# Altium schematic sheet hdmi_wing.SchDoc: POSEDGE HDMI Wing
size A4; Organization: www.posedge.ir; Address1: TORANJ Inc.; Address2: Isfahan Science and; Address3: Technology Town, Isfahan; Address4: IRAN; Revision: A
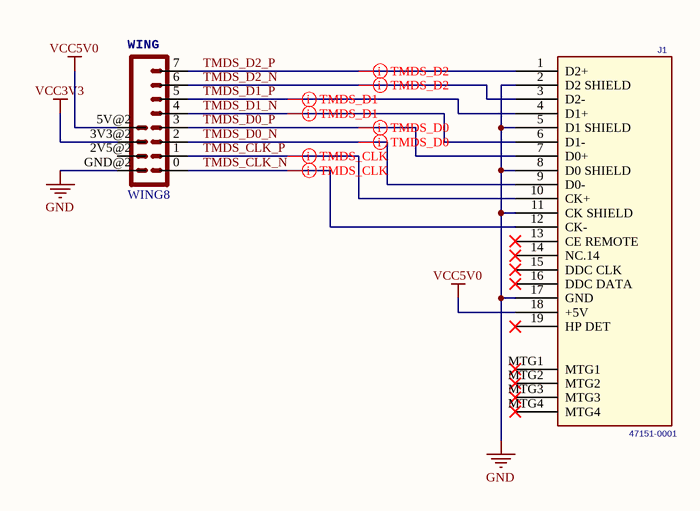
[diagram p0: hdmi_wing.SchDoc]

## Parts
J1  47151-0001  [HDMI_S_RA_SMD]
WING  WING8  [WINGSIDE_8BIT]

## Nets
GND: J1.2(D2_SHIELD) J1.5(D1_SHIELD) J1.8(D0_SHIELD) J1.11(CK_SHIELD) J1.17(GND) WING.GND@2(GND)
VCC3V3: WING.3V3@2(3V3)
VCC5V0: J1.18(+5V) WING.5V@2(5V)
TMDS_CLK_N: J1.12(CK-) WING.0
TMDS_CLK_P: J1.10(CK+) WING.1
TMDS_D0_N: J1.9(D0-) WING.2
TMDS_D0_P: J1.7(D0+) WING.3
TMDS_D1_N: J1.6(D1-) WING.4
TMDS_D1_P: J1.4(D1+) WING.5
TMDS_D2_N: J1.3(D2-) WING.6
TMDS_D2_P: J1.1(D2+) WING.7

Not connected (* = marked no-connect by the designer): J1 13(CE_REMOTE)* 14(NC.14)* 15(DDC_CLK)* 16(DDC_DATA)* 19(HP_DET)* MTG1* MTG2* MTG3* MTG4*; WING 2V5@2(2V5)

## Layout directives
differential pair: TMDS_CLK_N, TMDS_CLK_P, TMDS_D0_N, TMDS_D0_P, TMDS_D1_N, TMDS_D1_P, TMDS_D2_N, TMDS_D2_P

## Notes on the sheet
- Title
- Size:
- Date:
- A4
- Number:
- Revision:
- Sheet
- of

## Library data of the parts
J1 = 47151-0001: CONN RCPT 19POS HDMI RT ANG SMD; Manufacturer: Molex Connector Corporation; .Checked PCB: used; Number of Positions: 19; Pitch: 0.50mm (.020"); Gender: Receptacle; .Checked SCH: used; Category: Connectors, Interconnects; Connector Type: HDMI; Family: USB, IEEE-1394 (Firewire), DVI, HDMI; Manufacturer Part Number: 47151-0001; Operating Temperature: -20°C to +85°C; Price 1k [$]: 1.74610; Supplier: Digikey; Supplier Part Number: WM19086CT-ND; Value: 47151-0001; Supplier 1: Digi-Key; Supplier Part Number 1: WM19086CT-ND; RoHS: RoHS Compliant; Stock 1: 2756; Pricing 1: 1=3.1, 10=2.57, 50=2.1456, 100=1.9034 (USD); Number of Contacts: 19; Specifications: -; Mounting Type: Surface Mount, Right Angle, Horizontal; Features: Detent Lock; Packaging: Cut Tape (CT); Ingress Protection: -; ComponentLink1URL: http://www.molex.com/pdm_docs/sd/471510001_sd.pdf; ComponentLink1Description: http://www.molex.com/pdm_docs/sd/471510001_sd.pdf